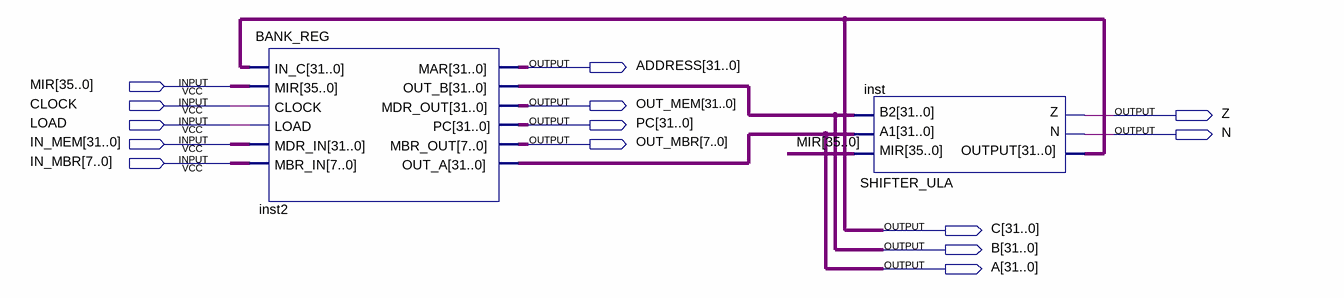
[diagram p0: schematic sheet]
// Quartus schematic DATAPATH.bdf as structural Verilog: 2 symbols, 14 pins
module DATAPATH (
  input  [35:0] MIR,
  input  CLOCK,
  input  LOAD,
  input  [31:0] IN_MEM,
  input  [7:0] IN_MBR,
  output [31:0] ADDRESS,
  output [31:0] OUT_MEM,
  output Z,
  output [31:0] PC,
  output N,
  output [7:0] OUT_MBR,
  output [31:0] C,
  output [31:0] B,
  output [31:0] A
);

  BANK_REG inst2 (
    .IN_C(C), .MIR(MIR), .CLOCK(CLOCK), .LOAD(LOAD), .MDR_IN(IN_MEM), .MBR_IN(IN_MBR), .MAR(ADDRESS),
    .OUT_B(B), .MDR_OUT(OUT_MEM), .PC(PC), .MBR_OUT(OUT_MBR), .OUT_A(A));
  SHIFTER_ULA inst (.MIR(MIR), .A1(A), .B2(B), .OUTPUT(C), .N(N), .Z(Z));
endmodule
